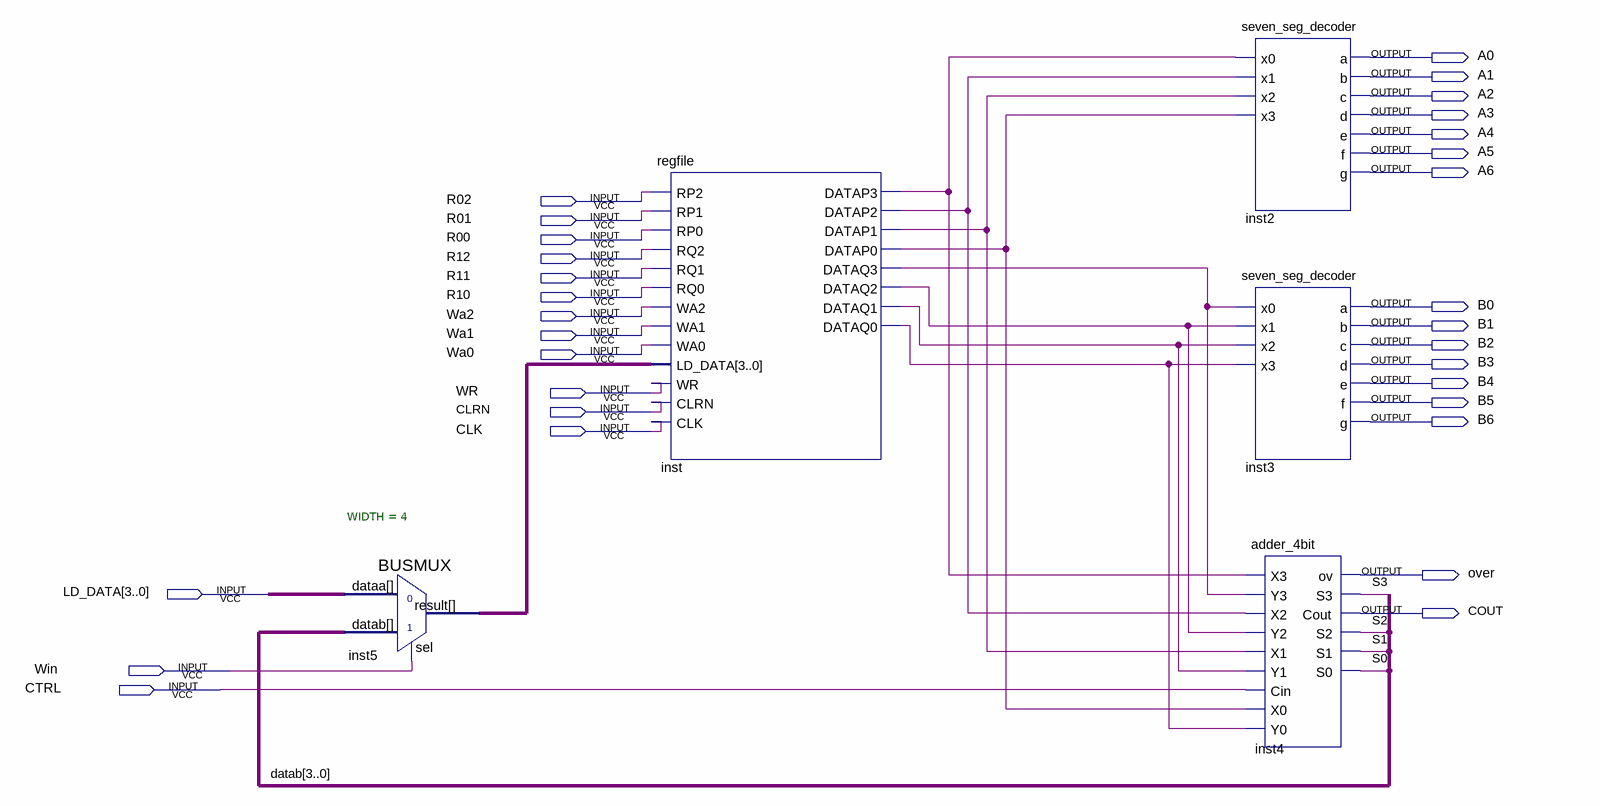
[diagram p0: schematic sheet]
// Quartus schematic final.bdf as structural Verilog: 5 symbols, 31 pins
module \final  (
  input  R02,
  input  R01,
  input  R00,
  input  R12,
  input  R11,
  input  R10,
  input  Wa2,
  input  Wa1,
  input  Wa0,
  input  WR,
  input  CLRN,
  input  CLK,
  input  [3:0] LD_DATA,
  input  Win,
  input  CTRL,
  output A0,
  output A1,
  output A2,
  output A3,
  output A4,
  output A5,
  output A6,
  output B0,
  output B1,
  output B2,
  output B3,
  output B4,
  output B5,
  output B6,
  output over,
  output COUT
);

  wire inst_datap0, inst_datap1, inst_datap2, inst_datap3, inst_dataq0, inst_dataq1, inst_dataq2,
       inst_dataq3, S0, S1, S2, S3;
  wire [3:0] datab, inst5_result;

  BUSMUX #(.WIDTH(4)) inst5 (.datab(datab), .sel(Win), .dataa(LD_DATA), .result(inst5_result));
  regfile inst (
    .RP2(R02), .RP1(R01), .RP0(R00), .RQ2(R12), .RQ1(R11), .RQ0(R10), .WA2(Wa2), .WA1(Wa1), .WA0(Wa0),
    .LD_DATA(inst5_result), .WR(WR), .CLRN(CLRN), .CLK(CLK), .DATAP3(inst_datap3), .DATAP2(inst_datap2),
    .DATAP1(inst_datap1), .DATAP0(inst_datap0), .DATAQ3(inst_dataq3), .DATAQ2(inst_dataq2),
    .DATAQ1(inst_dataq1), .DATAQ0(inst_dataq0));
  seven_seg_decoder inst2 (
    .x0(inst_datap3), .x1(inst_datap2), .x2(inst_datap1), .x3(inst_datap0), .a(A0), .b(A1), .c(A2), .d(A3),
    .e(A4), .f(A5), .g(A6));
  seven_seg_decoder inst3 (
    .x0(inst_dataq3), .x1(inst_dataq2), .x2(inst_dataq1), .x3(inst_dataq0), .a(B0), .b(B1), .c(B2), .d(B3),
    .e(B4), .f(B5), .g(B6));
  adder_4bit inst4 (
    .X3(inst_datap3), .Y3(inst_dataq3), .X2(inst_datap2), .Y2(inst_dataq2), .X1(inst_datap1),
    .Y1(inst_dataq1), .Cin(CTRL), .X0(inst_datap0), .Y0(inst_dataq0), .ov(over), .S3(S3), .Cout(COUT),
    .S2(S2), .S1(S1), .S0(S0));
endmodule
